# EasyEDA schematic lihini_pcb_2021-05-16.json
TITLE: Sheet_1; REV: 1.0; Date: 2021-04-17; Sheet: 1/1; Drawn By: Akila Sachintha; Company: Your Company
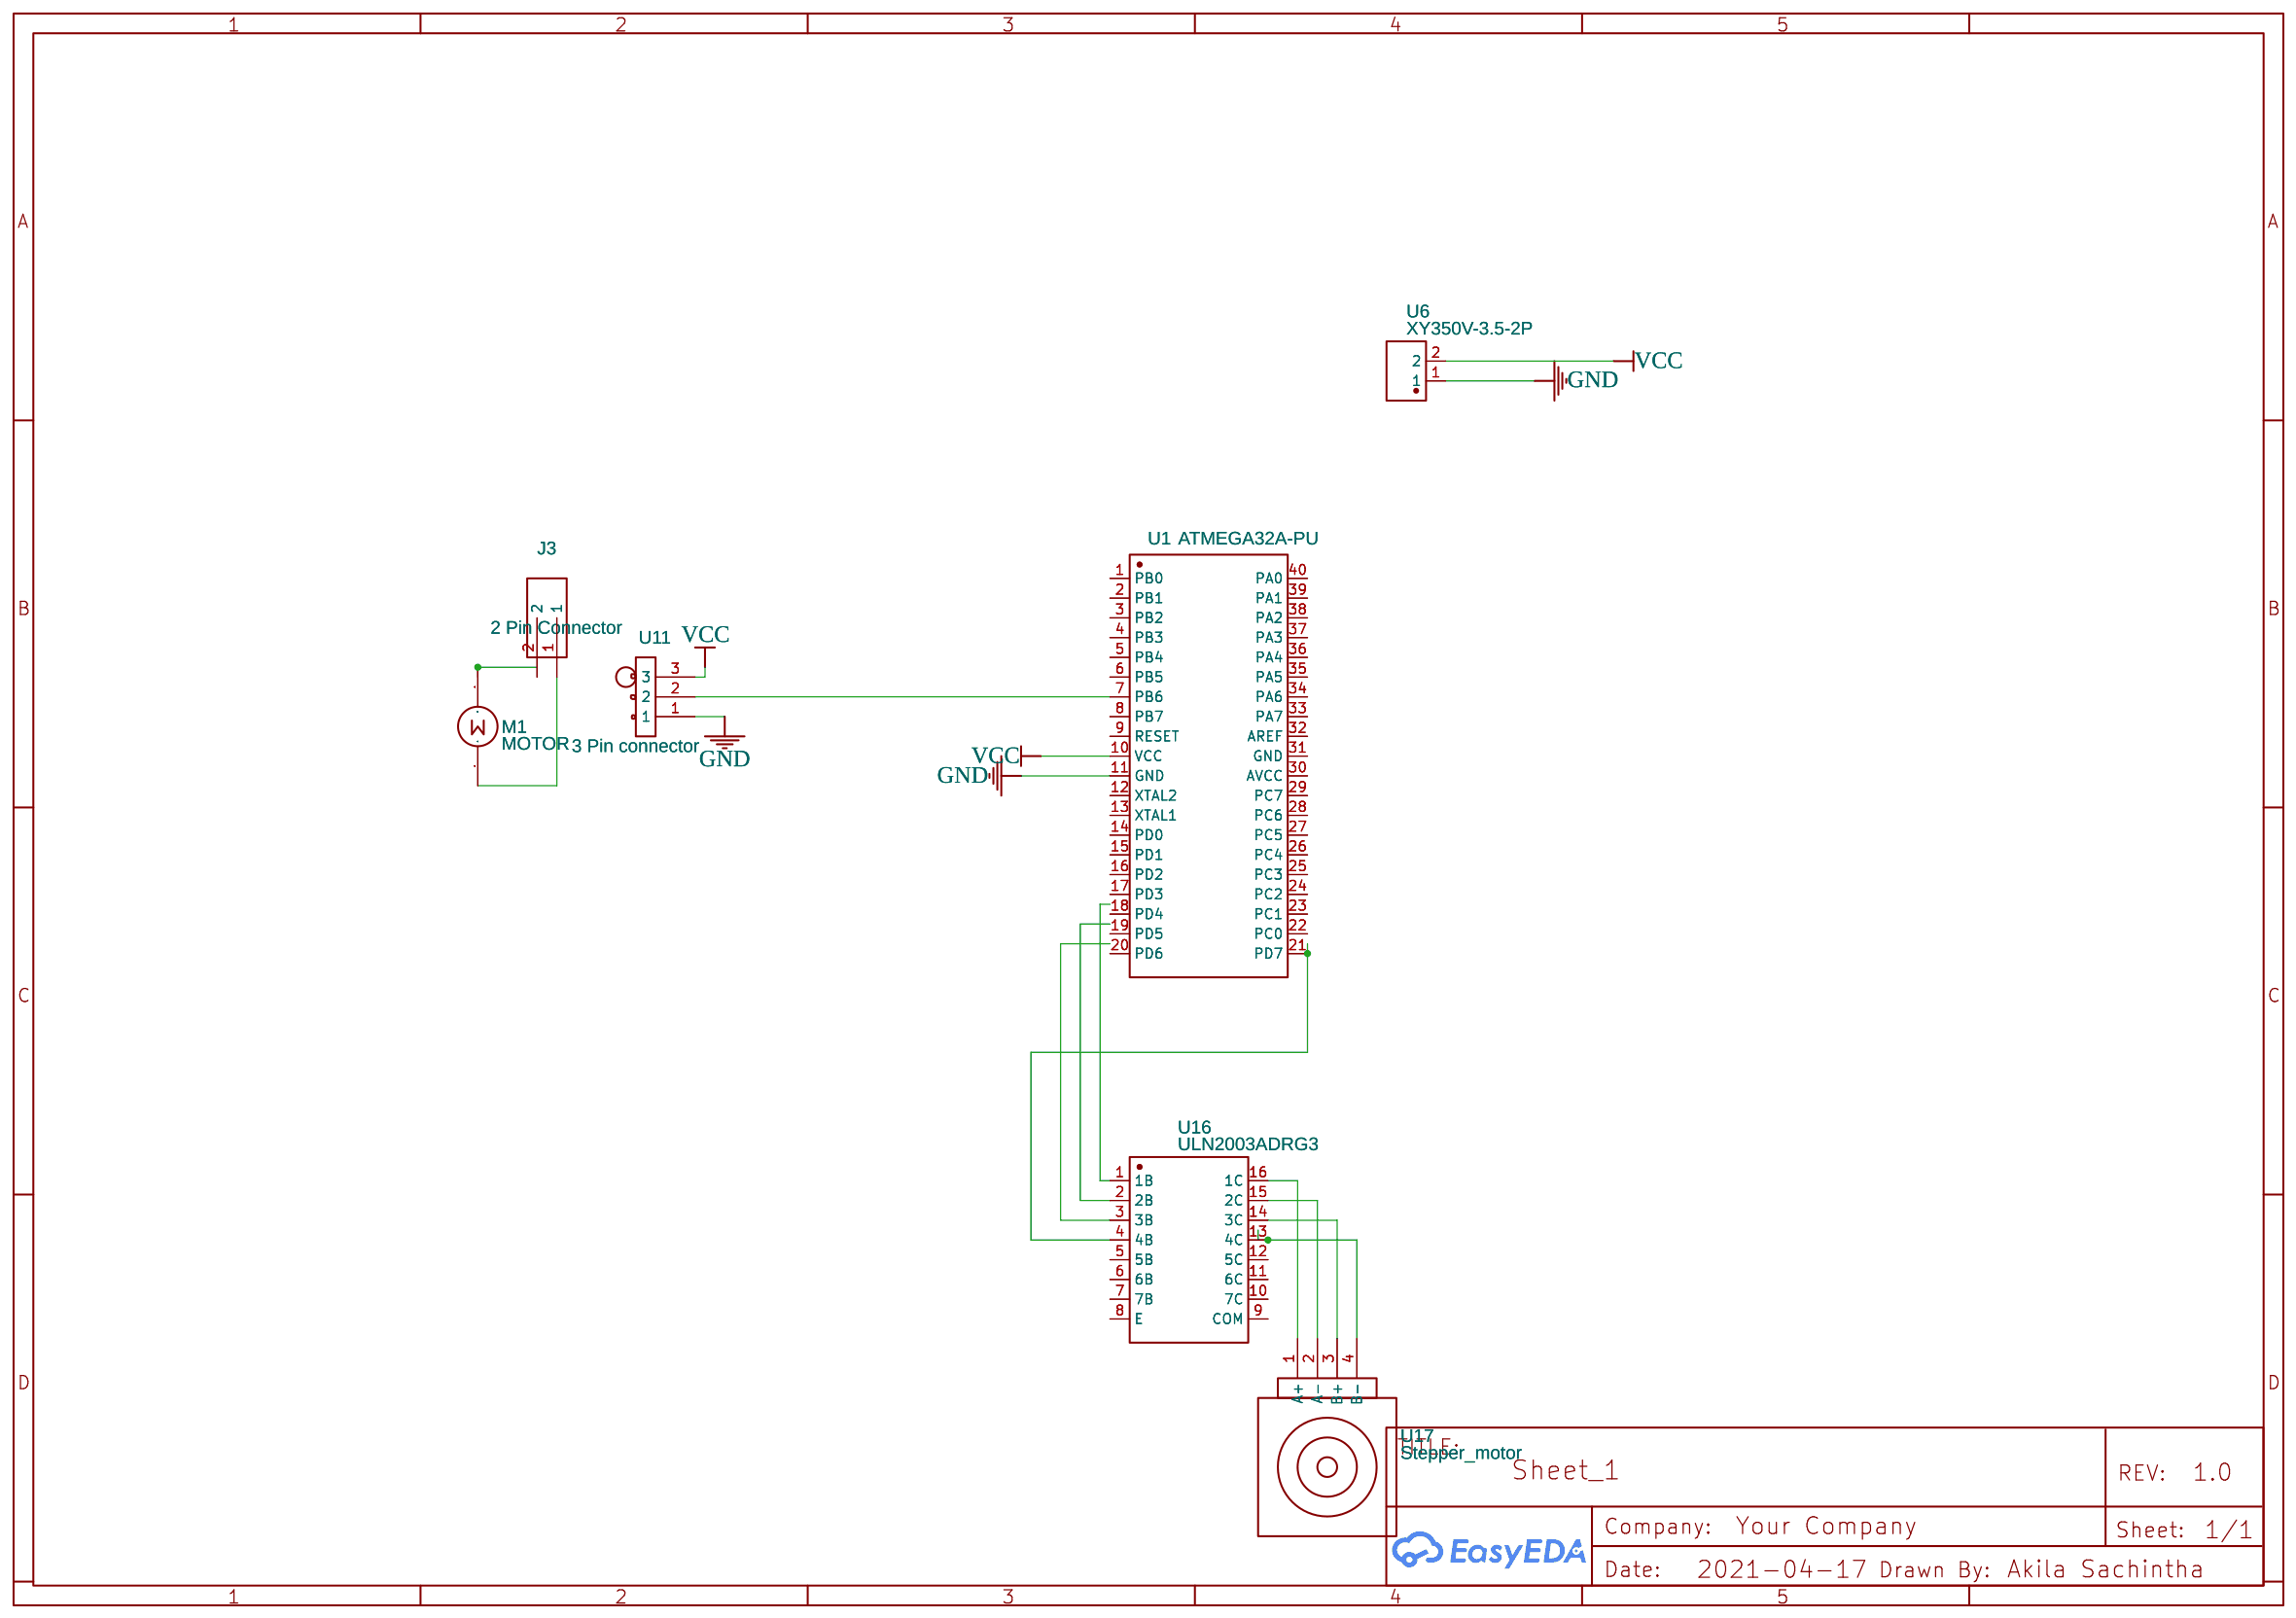
[diagram p0: schematic sheet]

## Parts
J3  2 Pin Connector  [2 PIN CONNECTOR]
M1  MOTOR  [CONECTOR GZ 2 PINES]
U1  ATMEGA32A-PU  [DIP-40_L52.3-W13.9-P2.54-LS15.2-BL]
U6  XY350V-3.5-2P  [CONN-TH_XY350V-3.5-2P]
U11  3 Pin connector  [PIN 3]
U16  ULN2003ADRG3  [SOIC-16]
U17  Stepper_motor  [CONN-TH_4P_XHB-4A]

## Library data of the parts
J3 = 2 Pin Connector: Contributor: dudeitsraymond
M1 = MOTOR: Contributor: Junikos
U1 = ATMEGA32A-PU: Supplier: LCSC; Manufacturer: MICROCHIP; image: //image.lceda.cn/szlcsc/C12703.jpg; Supplier Part: C12703
U6 = XY350V-3.5-2P: Supplier: LCSC; Supplier Part: C784942; Manufacturer: Ningbo Xinlaiya Elec.; Contributor: LCSC; LCSC Assembly: Yes; SMT Type: Extend; Paste Type: expand
U11 = 3 Pin connector: Manufacturer Part: pin 3; Contributor: Mael98
U16 = ULN2003ADRG3
U17 = Stepper_motor: Manufacturer Part: NEMA 23 Stepper Motor; Contributor: drift developers

## Nets
GND: U1.11(GND) U6.1 U11.1
VCC: U1.10(VCC) U6.2 U11.3
Net-(J3-1): J3.1 M1.1
Net-(U1-7): U1.7(PB6) U11.2
Net-(U1-21): U1.21(PD7) U16.4(4B)
Net-(U16-13): U16.13(4C) U17.4(B-)
Net-(U16-14): U16.14(3C) U17.3(B+)
Net-(U16-15): U16.15(2C) U17.2(A-)
Net-(U16-16): U16.16(1C) U17.1(A+)

Not connected (* = marked no-connect by the designer): J3 2; M1 2; U1 1(PB0) 2(PB1) 3(PB2) 4(PB3) 5(PB4) 6(PB5) 8(PB7) 9(RESET) 12(XTAL2) 13(XTAL1) 14(PD0) 15(PD1) 16(PD2) 17(PD3) 18(PD4) 19(PD5) 20(PD6) 22(PC0) 23(PC1) 24(PC2) 25(PC3) 26(PC4) 27(PC5) 28(PC6) 29(PC7) 30(AVCC) 31(GND) 32(AREF) 33(PA7) 34(PA6) 35(PA5) 36(PA4) 37(PA3) 38(PA2) 39(PA1) 40(PA0); U16 1(1B) 2(2B) 3(3B) 5(5B) 6(6B) 7(7B) 8(E) 9(COM) 10(7C) 11(6C) 12(5C)
